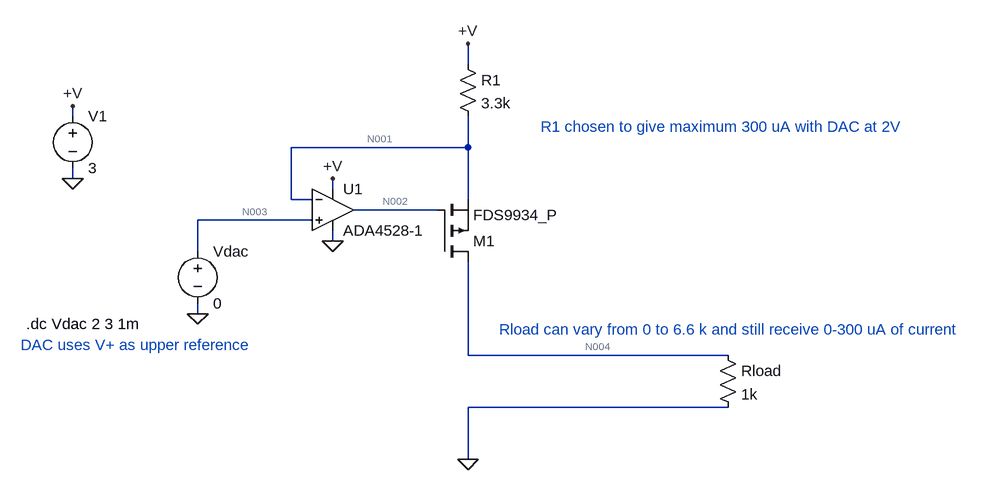
[diagram p0: schematic p-mosfet-current-source.asc]
p-mosfet-current-source.asc, the LTspice schematic file:
Version 4
SHEET 1 1104 680
WIRE 288 -16 288 -48
WIRE -320 64 -320 48
WIRE 288 112 288 64
WIRE 288 112 16 112
WIRE -320 160 -320 144
WIRE 80 176 80 160
WIRE 16 192 16 112
WIRE 48 192 16 192
WIRE 288 192 288 112
WIRE 240 208 112 208
WIRE 48 224 -128 224
WIRE 80 256 80 240
WIRE -128 272 -128 224
WIRE -128 368 -128 352
WIRE 288 432 288 288
WIRE 688 432 288 432
WIRE 688 512 288 512
WIRE 288 592 288 512
FLAG 80 256 0
FLAG 80 160 +V
FLAG 288 -48 +V
FLAG -128 368 0
FLAG -320 160 0
FLAG -320 48 +V
FLAG 288 592 0
SYMBOL res 272 -32 R0
SYMATTR InstName R1
SYMATTR Value 3.3k
SYMBOL res 672 416 R0
SYMATTR InstName Rload
SYMATTR Value 1k
SYMBOL voltage -320 48 R0
WINDOW 123 0 0 Left 0
WINDOW 39 0 0 Left 0
SYMATTR InstName V1
SYMATTR Value 3
SYMBOL voltage -128 256 R0
WINDOW 123 0 0 Left 0
WINDOW 39 0 0 Left 0
SYMATTR InstName Vdac
SYMATTR Value 0
SYMBOL Opamps\\ADA4528-1 80 144 R0
SYMATTR InstName U1
SYMBOL pmos 240 288 M180
SYMATTR InstName M1
SYMATTR Value FDS9934_P
TEXT -392 384 Left 2 !.dc Vdac 2 3 1m
TEXT 336 392 Left 2 ;Rload can vary from 0 to 6.6 k and still receive 0-300 uA of current
TEXT -400 416 Left 2 ;DAC uses V+ as upper reference
TEXT 400 80 Left 2 ;R1 chosen to give maximum 300 uA with DAC at 2V

The netlist it stands for:
* p-mosfet-current-source.asc
R1 +V N001 3.3k
Rload N004 0 1k
V1 +V 0 3
Vdac N003 0 0
XU1 N003 N001 +V 0 N002 ADA4528-1  ; pins In+ In- V+ V- OUT
M1 N004 N002 N001 N001 FDS9934_P
.model NMOS NMOS
.model PMOS PMOS
.lib standard.mos
.dc Vdac 2 3 1m
* Rload can vary from 0 to 6.6 k and still receive 0-300 uA of current
* DAC uses V+ as upper reference
* R1 chosen to give maximum 300 uA with DAC at 2V
.backanno
.end

* Results of the author's LTspice run, read from the files saved beside the schematic
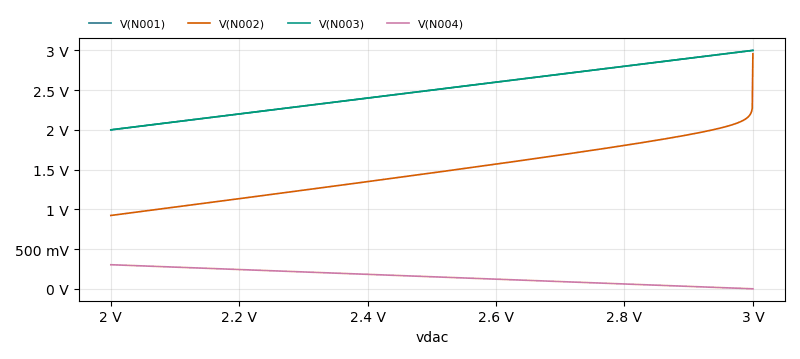
[diagram p1: DC transfer characteristic of p-mosfet-current-source.asc, plotted from the saved traces]
* DC transfer characteristic, 1 run:
*   V(N001): 2 V at vdac=2 V, 3 V at vdac=3 V, min 2 V, max 3 V
*   V(N002): 922.7 mV at vdac=2 V, 2.958 V at vdac=3 V, min 922.7 mV, max 2.958 V
*   V(N003): 2 V at vdac=2 V, 3 V at vdac=3 V, min 2 V, max 3 V
*   V(N004): 303 mV at vdac=2 V, 24.32 nV at vdac=3 V, min 24.32 nV, max 303 mV